# Altium schematic sheet P01_Title .SchDoc
size 386 x 246 mm
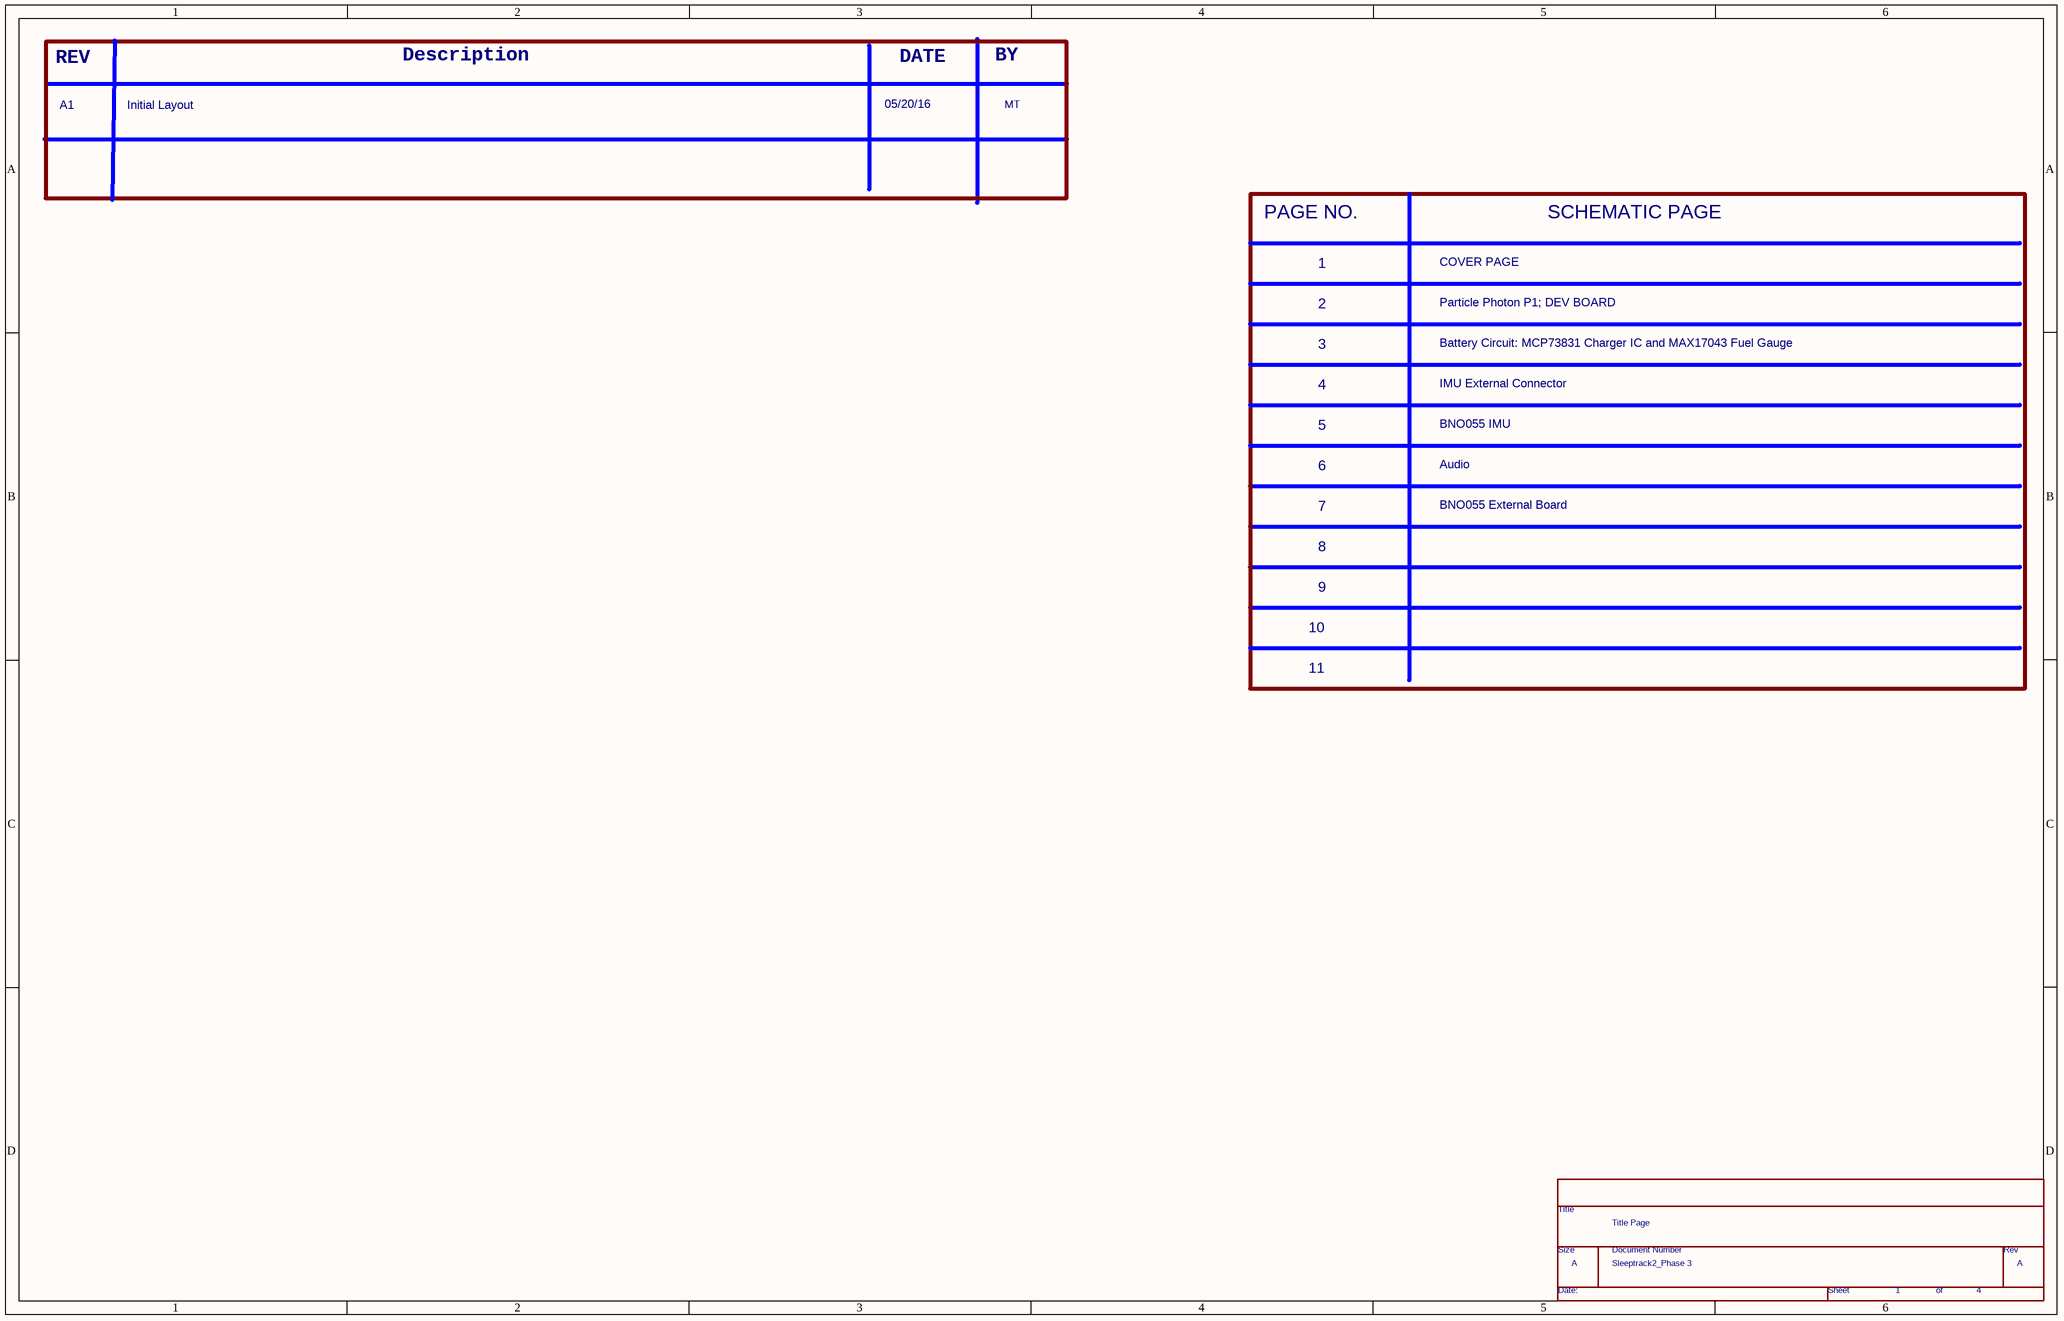
[diagram p0: P01_Title .SchDoc]

## Parts
*  Doc: Sleeptrack2_Phase 3  RevCode: A  Title: Title Page  Page Number: 1  Page Count: 4  (hidden comment: TitleBlock0)  (graphical)

## Notes on the sheet
- REV
- A1
- Initial Layout
- Description
- 05/20/16
- DATE
- BY
- MT
- PAGE NO.
- SCHEMATIC PAGE
- 1
- 2
- Particle Photon P1; DEV BOARD
- COVER PAGE
- 3
- 4
- IMU External Connector
- Battery Circuit: MCP73831 Charger IC and MAX17043 Fuel Gauge
- 5
- BNO055 IMU
- 7
- 6
- Audio
- BNO055 External Board
- 8
- 9
- 10
- 11
- (in symbol TitleBlock0) Title; Size; Document Number; Rev; Date:; Sheet; of

## Library data of the parts
* = TitleBlock0: Page Create Date: March  8, 1995; Page Size: A